# EAGLE board PS4_Main_Schematic_V3 (EAGLE 9.5.2)
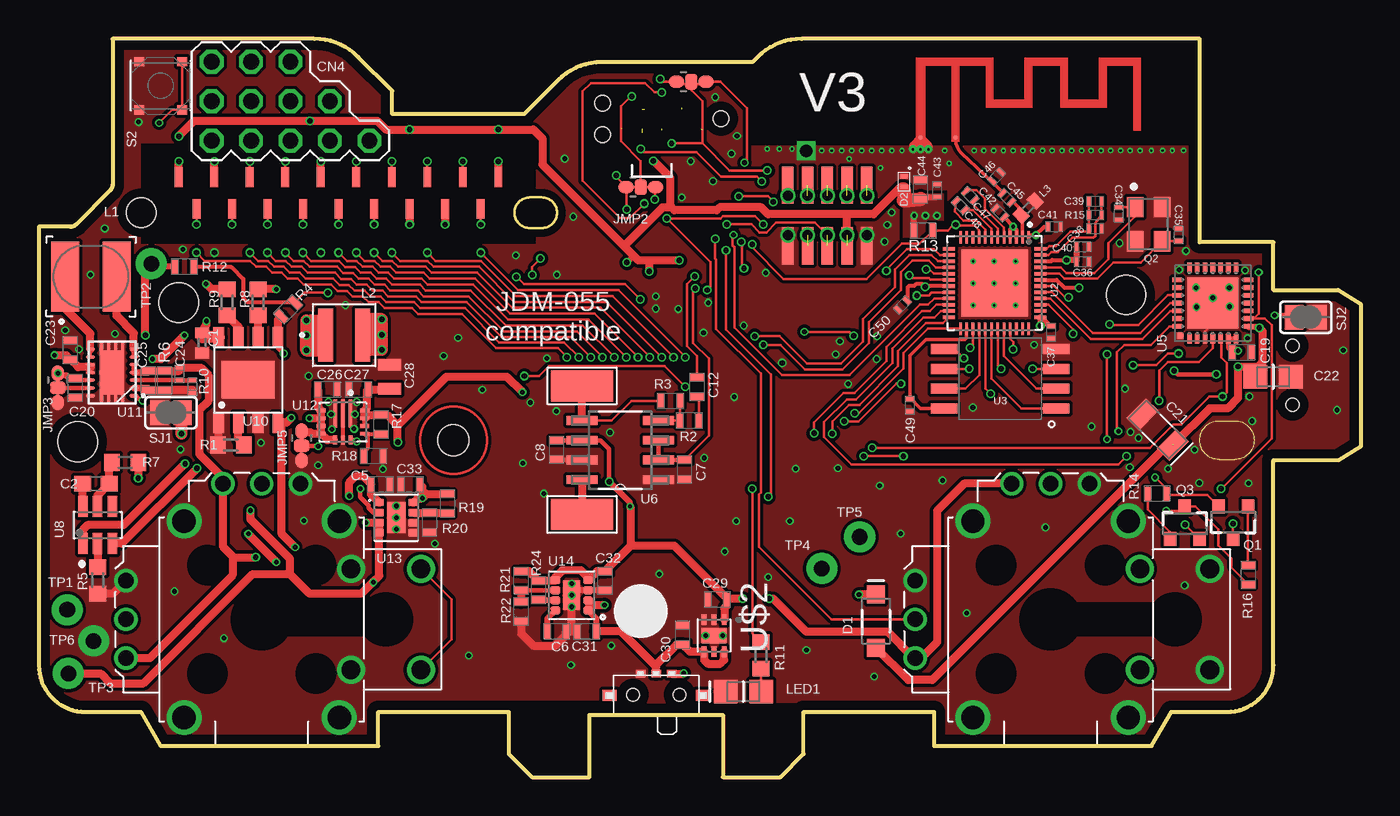
[diagram p2: board, top side]
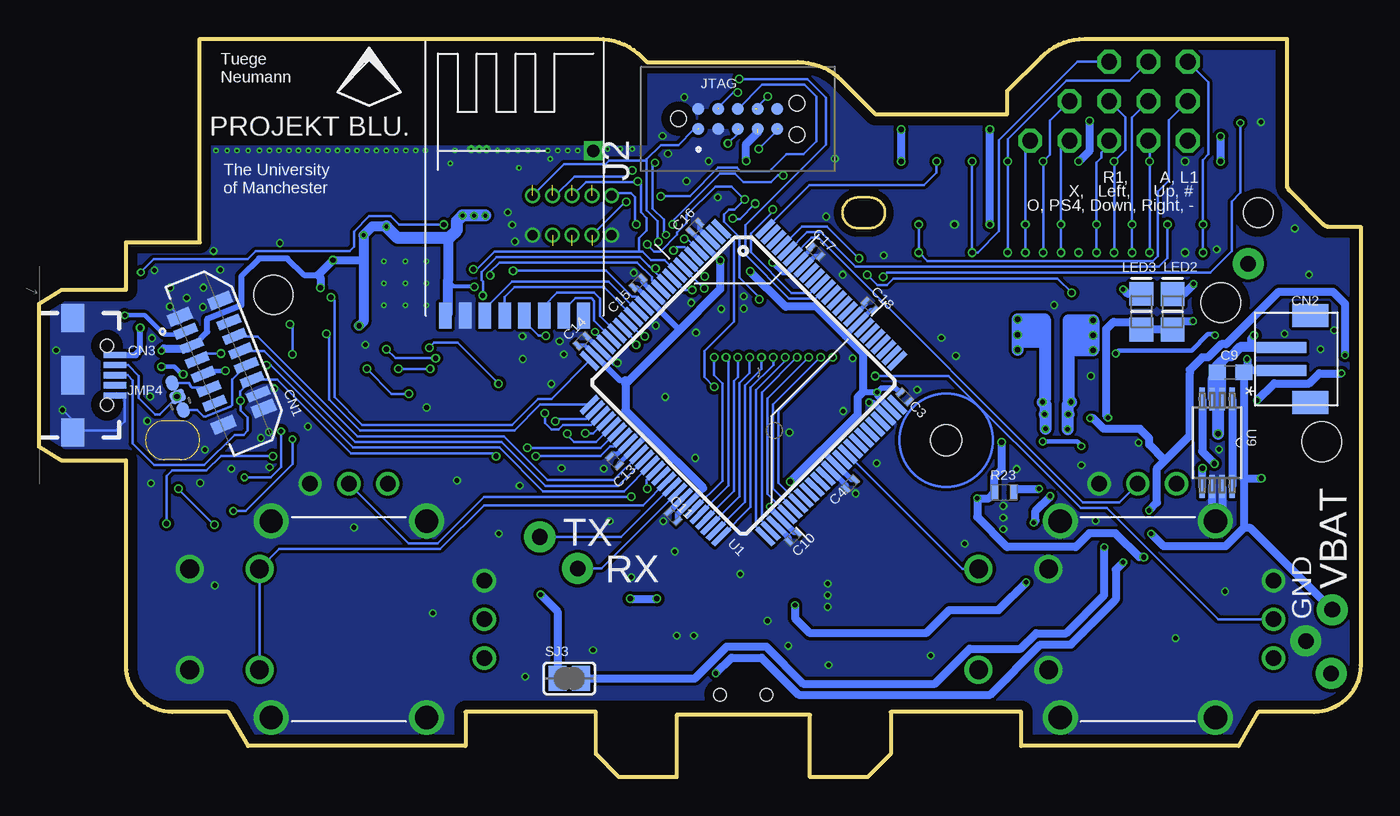
[diagram p3: board, bottom side, seen from below]

Size 85.11 x 47.55 mm. Coordinates in mm from the lower left corner, seen from the top.
Outline: 2.04,35.45 0,35.45 0,7.2 arc90 3,4.2 6.58,4.2 7.85,2 21.85,2 21.85,4.2 30.25,4.2 30.25,1.5 31.75,0 35.45,0 35.45,4 44.05,4 44.05,0 47.75,0 49.25,1.5 49.25,4.2 57.65,4.2 57.65,2 71.65,2 72.92,4.2 76.5,4.2 arc90 79.5,7.2 79.5,20.4 83.67,20.4 85.11,21.29 85.11,30.48 83.67,31.37 79.5,31.37 79.5,34.45 74.75,34.45 74.75,47.55 49.11,47.55 arc45 46.28,46.38 45.95,46.05 36.26,46.05 arc45 33.43,44.88 31.25,42.7 22.75,42.7 22.75,44.2 20.57,46.38 arc45 17.74,47.55 4.75,47.55 4.75,38.16 arc-45 4.6,37.8 2.4,35.6 arc-45 2.04,35.45
Copper layers (1*16): Top 0.035mm / dielectric 0.825mm / Bottom 0.035mm
Design rules "default *": minimum track width 0.1mm, minimum drill 0.2mm, track to track 0.1mm, track to pad 0.1mm, pad to pad 0.1mm, via to via 0mil, smd to smd 0.1mm, copper to edge 0.6mm, drill to drill 5mil, minimum pad ring 0.1mm, minimum via ring 0.1mm, stop-mask expansion 4mil, vias tented up to drill 0mil, thermal gap 0mil
Net classes: 0 Signals: width 0.152 mm, drill 0.3 mm, clearance 0.205 mm; 1 +5V: width 0.508 mm, drill 0.3 mm, clearance 0.205 mm; 2 +3V3: width 0.381 mm, drill 0.3 mm, clearance 0.205 mm; 3 GND: width 0.381 mm, drill 0.3 mm, clearance 0.205 mm
Holes 2.5 mm at 70,31.05
Holes 2.54 mm at 9,30.55 2.5,21.6
Holes 2 mm at 26.7,21.7
tRestrict: area 46,40.7 to 74.8,47.5; area 19.7,24.3 to 20.9,24.5; area 20.5,23.9 to 20.7,24.3; area 18.3,24.3 to 19.5,24.5; area 18.3,23.9 to 18.5,24.3; area 19.7,22 to 19.9,22.5; area 19.3,22 to 19.5,22.5; area 30.4,0.1 to 36.2,4.9; area 43.4,-0.2 to 49.1,4.7
bRestrict: area 46,40.7 to 74.8,47.5; area 41.8,0.1 to 49.2,4.9; area 30.4,0.1 to 36.2,4.9
Milling: 4 lines

## Footprints (pad centres in the part's own frame; a part is rotated, then mirrored left to right if it is on the bottom)
ESP32-ANT = smd 0.295 x 0.295: FEED 0.877,0.457; GND -1.359,0.457
C0402 = smd 0.7 x 0.9: 1 -0.65,0; 2 0.65,0
C0603 = smd 1.1 x 1: 1 -0.85,0; 2 0.85,0
CAPC1005X60N = smd 0.305 x 0.61: 1 -0.406,0; 2 0.406,0
CAPC1608X85N = smd 0.457 x 0.864: 1 -0.61,0; 2 0.61,0
TAN-A = smd 1.118 x 1.778: 1 0,0; 2 2.794,0
CAP0805-NP = smd 1.524 x 1.524: 1 0,0; 2 2.286,0
0805 = smd 0.737 x 1.473: 1 -0.762,0; 2 0.762,0
FFC-12-VERTICAL = smd 0.8 x 1.5: GND1 -3.75,-1.4; GND2 -3.75,1.4; GND3 3.75,-1.4; GND4 3.75,1.4 | smd 0.6 x 1.5: P$1 2.75,1.4; P$2 2.25,-1.4; P$3 1.75,1.4; P$4 1.25,-1.4; P$5 0.75,1.4; P$6 0.25,-1.4; P$7 -0.25,1.4; P$8 -0.75,-1.4; P$9 -1.25,1.4; P$10 -1.75,-1.4; P$11 -2.25,1.4; P$12 -2.75,-1.4
B2B-SM = smd 0.7 x 3.2: P$1 -0.75,3.6; P$2 0.75,3.6 | smd 1.5 x 2.3: P$3 -2.8,1.75; P$4 2.8,1.75
USB-B-MICRO-SMD-RED-OVERHANG = smd 1.45 x 0.4: D+ 2.725,0; D- 2.725,0.65; GND 2.725,-1.3; ID 2.725,-0.65; VBUS 2.725,1.3 | smd 1.5 x 1.8: SHIELD1 0,3.685; SHIELD2 0,-3.685 | smd 1.5 x 2.5: SHIELD3 0,0 | hole 0.85: 2.2,1.9; 2.2,-1.9
MA05-2 = drill 1.016 octagon: 1 -5.08,-1.27; 2 -5.08,1.27; 3 -5.08,3.81; 4 -2.54,-1.27; 5 -2.54,1.27; 6 -2.54,3.81; 7 0,-1.27; 8 0,1.27; 9 0,3.81; 10 2.54,-1.27; 11 2.54,1.27; 12 5.08,-1.27
CARBON-PADS-JDM055 = smd 0.508 x 1.27: 1 22.987,2.286; 2 21.844,0.254; 3 20.701,2.286; 4 19.558,0.254; 5 18.415,2.286; 6 17.272,0.254; 7 16.129,2.286; 8 14.986,0.254; 9 13.843,2.286; 10 12.7,0.254; 11 11.557,2.286; 12 10.414,0.254; 13 9.271,2.286; 14 8.128,0.254; 15 6.985,2.286; 16 5.842,0.254; 17 4.699,2.286; 18 3.556,0.254; 19 2.413,2.286 | hole 1.905: 0,0
SOD-123 = smd 1.143 x 1.143: 1 0,0; 2 3.429,0
DFN100X60X45-2N = smd 0.28 x 0.52: 1 -0.325,0; 2 0.325,0
TAG-CONNECT_TC2050-IDC-NL = smd 0.787 x 0.787: 1 0,0; 2 0,-1.27; 3 0,-2.54; 4 0,-3.81; 5 0,-5.08; 6 1.27,-5.08; 7 1.27,-3.81; 8 1.27,-2.54; 9 1.27,-1.27; 10 1.27,0 | hole 0.991: 1.65,-6.35; -0.38,-6.35; 0.635,1.27
C0R-JMP = smd 0.8 x 1: 1 0,0.938; 3 0,-0.938 | smd 1 x 0.8: 2 0,0
RKJXV1224 = drill 1.2: BTN1 3.25,-5.75; BTN2 3.25,-10.25; BTN3 -3.25,-5.75; BTN4 -3.25,-10.25 | drill 1.5: CASE1 6.325,5; CASE2 -6.325,5; CASE3 -6.325,-5; CASE4 6.325,-5 | drill 1: X1 8.73,-2.5; X2 8.73,0; X3 8.73,2.5; Y1 2.5,8.73; Y2 0,8.73; Y3 -2.5,8.73
M50-3600542 = drill 0.65 pad 0.889: P10_1 2.54,1.27; P$1_1 -2.54,-1.27; P$2_1 -2.54,1.27; P$3_1 -1.27,-1.27; P$4_1 -1.27,1.27; P$5_1 0,-1.27; P$6_1 0,1.27; P$7_1 1.27,-1.27; P$8_1 1.27,1.27; P$9_1 2.54,-1.27 | smd 0.74 x 2.4: P$1 -2.54,-1.95; P$2 -2.54,1.95; P$3 -1.27,-1.95; P$4 -1.27,1.95; P$5 0,-1.95; P$6 0,1.95; P$7 1.27,-1.95; P$8 1.27,1.95; P$9 2.54,-1.95; P$10 2.54,1.95
IND_SDR0403-221KL = smd 4.5 x 1.8: 1 0,1.65; 2 0,-1.65
IND_XFL4020-102MEB = smd 0.98 x 3.4: 1 -1.185,0; 2 1.185,0
INDC1005X45 = smd 0.7 x 0.9: 1 -0.65,0; 2 0.65,0
LED0805 = smd 1.524 x 1.524: 1 0,0; 2 2.286,0
SPEAKER-CONNECTORS-JDM055 = smd 4 x 2: P$1 0,4.14; P$2 0,-4.14
SOT23-3 = smd 0.8 x 0.9: 1 -0.95,-1; 2 0.95,-1; 3 0,1.1
OSCCC320X250X60N = smd 1.31 x 1.06: 1 -1.1,-0.875; 2 1.1,-0.875; 3 1.1,0.875; 4 -1.1,0.875
R0603 = smd 1 x 1.1: 1 -0.85,0; 2 0.85,0
603-AC0402FR-0720KL = smd 0.305 x 0.61: 1 -0.406,0; 2 0.406,0
SSAJ110100 = smd 0.6 x 0.5: 1 -1,2.6; 2 1,2.6; C 0,2.6 | smd 0.9 x 0.7: PAD@1 3,1.2; PAD@2 -3,1.2 | hole 0.8: -1.5,1.25; 1.5,1.25
PTS540 = smd 0.6 x 0.65: 1 -1.55,1.375; 2 1.55,1.375; 3 -1.55,-1.375; 4 1.55,-1.375
SJ = smd 1.168 x 1.6: 1 -0.762,0; 2 0.762,0
SJ-CLOSED = smd 1.168 x 1.6: 1 -0.762,0; 2 0.762,0
TP = drill 1 pad 2: TP 0,0
TQFP100 = smd 1.5 x 0.35: 1 -8,6; 2 -8,5.5; 3 -8,5; 4 -8,4.5; 5 -8,4; 6 -8,3.5; 7 -8,3; 8 -8,2.5; 9 -8,2; 10 -8,1.5; 11 -8,1; 12 -8,0.5; 13 -8,0; 14 -8,-0.5; 15 -8,-1; 16 -8,-1.5; 17 -8,-2; 18 -8,-2.5; 19 -8,-3; 20 -8,-3.5; 21 -8,-4; 22 -8,-4.5; 23 -8,-5; 24 -8,-5.5; 25 -8,-6; 51 8,-6; 52 8,-5.5; 53 8,-5; 54 8,-4.5; 55 8,-4; 56 8,-3.5; 57 8,-3; 58 8,-2.5; 59 8,-2; 60 8,-1.5; 61 8,-1; 62 8,-0.5; 63 8,0; 64 8,0.5; 65 8,1; 66 8,1.5; 67 8,2; 68 8,2.5; 69 8,3; 70 8,3.5; 71 8,4; 72 8,4.5; 73 8,5; 74 8,5.5; 75 8,6 | smd 0.35 x 1.5: 26 -6,-8; 27 -5.5,-8; 28 -5,-8; 29 -4.5,-8; 30 -4,-8; 31 -3.5,-8; 32 -3,-8; 33 -2.5,-8; 34 -2,-8; 35 -1.5,-8; 36 -1,-8; 37 -0.5,-8; 38 0,-8; 39 0.5,-8; 40 1,-8; 41 1.5,-8; 42 2,-8; 43 2.5,-8; 44 3,-8; 45 3.5,-8; 46 4,-8; 47 4.5,-8; 48 5,-8; 49 5.5,-8; 50 6,-8; 76 6,8; 77 5.5,8; 78 5,8; 79 4.5,8; 80 4,8; 81 3.5,8; 82 3,8; 83 2.5,8; 84 2,8; 85 1.5,8; 86 1,8; 87 0.5,8; 88 0,8; 89 -0.5,8; 90 -1,8; 91 -1.5,8; 92 -2,8; 93 -2.5,8; 94 -3,8; 95 -3.5,8; 96 -4,8; 97 -4.5,8; 98 -5,8; 99 -5.5,8; 100 -6,8
QFN35P500X500X90-49N = smd 0.81 x 0.22: 1 -2.945,2.2; 2 -2.945,1.8; 3 -2.945,1.4; 4 -2.945,1; 5 -2.945,0.6; 6 -2.945,0.2; 7 -2.945,-0.2; 8 -2.945,-0.6; 9 -2.945,-1; 10 -2.945,-1.4; 11 -2.945,-1.8; 12 -2.945,-2.2; 25 2.945,-2.2; 26 2.945,-1.8; 27 2.945,-1.4; 28 2.945,-1; 29 2.945,-0.6; 30 2.945,-0.2; 31 2.945,0.2; 32 2.945,0.6; 33 2.945,1; 34 2.945,1.4; 35 2.945,1.8; 36 2.945,2.2 | smd 0.22 x 0.81: 13 -2.2,-2.945; 14 -1.8,-2.945; 15 -1.4,-2.945; 16 -1,-2.945; 17 -0.6,-2.945; 18 -0.2,-2.945; 19 0.2,-2.945; 20 0.6,-2.945; 21 1,-2.945; 22 1.4,-2.945; 23 1.8,-2.945; 24 2.2,-2.945; 37 2.2,2.945; 38 1.8,2.945; 39 1.4,2.945; 40 1,2.945; 41 0.6,2.945; 42 0.2,2.945; 43 -0.2,2.945; 44 -0.6,2.945; 45 -1,2.945; 46 -1.4,2.945; 47 -1.8,2.945; 48 -2.2,2.945 | smd 4.3 x 4.3: 49 0,0
SOIC127P790X216-8N = smd 1.7 x 0.65: 1 -3.6,1.905; 2 -3.6,0.635; 3 -3.6,-0.635; 4 -3.6,-1.905; 5 3.6,-1.905; 6 3.6,-0.635; 7 3.6,0.635; 8 3.6,1.905
NRF24MINI = smd 1.676 x 0.813: 3V3 0,8.89; CE 0,6.35; CSN 0,5.08; GND 0,7.62; IRQ 0,0; MISO 0,1.27; MOSI 0,2.54; SCK 0,3.81 | drill 0.8 square: GND2 10.625,-0.625
MLP28 = smd 0.6 x 0.3: 1 -2.3,1.5; 2 -2.3,1; 3 -2.3,0.5; 4 -2.3,0; 5 -2.3,-0.5; 6 -2.3,-1; 7 -2.3,-1.5; 15 2.3,-1.5; 16 2.3,-1; 17 2.3,-0.5; 18 2.3,0; 19 2.3,0.5; 20 2.3,1; 21 2.3,1.5 | smd 0.3 x 0.6: 8 -1.5,-2.3; 9 -1,-2.3; 10 -0.5,-2.3; 11 0,-2.3; 12 0.5,-2.3; 13 1,-2.3; 14 1.5,-2.3; 22 1.5,2.3; 23 1,2.3; 24 0.5,2.3; 25 0,2.3; 26 -0.5,2.3; 27 -1,2.3; 28 -1.5,2.3 | smd 3.3 x 3.3: EXP 0,0 | smd 0.435 x 0.435: M -2.103,2.103
SOIC127P600X175-8N = smd 1.981 x 0.559: 1 -2.464,1.905; 2 -2.464,0.635; 3 -2.464,-0.635; 4 -2.464,-1.905; 5 2.464,-1.905; 6 2.464,-0.635; 7 2.464,0.635; 8 2.464,1.905
SOT95P285X140-6N = smd 1.35 x 0.6: 1 -1.185,0.95; 2 -1.185,0; 3 -1.185,-0.95; 4 1.185,-0.95; 5 1.185,0; 6 1.185,0.95
SOP65P640X120-8N = smd 1.473 x 0.356: 1 -2.819,0.965; 2 -2.819,0.33; 3 -2.819,-0.33; 4 -2.819,-0.965; 5 2.819,-0.965; 6 2.819,-0.33; 7 2.819,0.33; 8 2.819,0.965
SOP-8 = smd 1.3 x 0.7: 1 -2.75,1.905; 2 -2.75,0.635; 3 -2.75,-0.635; 4 -2.75,-1.905; 5 2.75,-1.905; 6 2.75,-0.635; 7 2.75,0.635; 8 2.75,1.905 | smd 2.413 x 3.429: 9 0,0
QFN14-3X4MM = smd 0.6 x 0.24: 1 -1.4,1.5; 2 -1.4,1; 3 -1.4,0.5; 4 -1.4,0; 5 -1.4,-0.5; 6 -1.4,-1; 7 -1.4,-1.5; 8 1.4,-1.5; 9 1.4,-1; 10 1.4,-0.5; 11 1.4,0; 12 1.4,0.5; 13 1.4,1; 14 1.4,1.5 | smd 1.58 x 2.85: 15 0,0 | smd 0.2 x 0.575: 16 -0.69,1.712; 17 -0.23,1.712; 18 0.23,1.712; 19 0.69,1.712; 20 0.69,-1.712; 21 0.23,-1.712; 22 -0.23,-1.712; 23 -0.69,-1.712
TPS630250 = smd 1.79 x 0.22: 1 -0.555,0.49; 3 -0.555,-0.49 | smd 1.79 x 0.24: 2 -0.555,0 | smd 0.24 x 0.6: 4 -0.75,-1.4; 5 -0.25,-1.4; 6 0.25,-1.4; 7 0.75,-1.4; 11 0.75,1.4; 12 0.25,1.4; 13 -0.25,1.4; 14 -0.75,1.4 | smd 0.6 x 0.24: 8 1.15,-0.5; 9 1.15,0; 10 1.15,0.5
SON65P280X300X133-9N = smd 0.63 x 0.5: 1 -1.1,0.975; 2 -1.1,0.325; 3 -1.1,-0.325; 4 -1.1,-0.975; 5 1.1,-0.975; 6 1.1,-0.325; 7 1.1,0.325; 8 1.1,0.975 | smd 1.2 x 2: 9 0,0 | drill 0.3 pad 0.5: P$1 0,0; P$2 0,0.75; P$3 0,-0.75
PSON65P300X280X153-9N = smd 0.63 x 0.5: 1 -1.05,0.975; 2 -1.05,0.325; 3 -1.05,-0.325; 4 -1.05,-0.975; 5 1.05,-0.975; 6 1.05,-0.325; 7 1.05,0.325; 8 1.05,0.975 | smd 1.1 x 1.9: 9 0,0 | drill 0.3 pad 0.5: 9_1 0,0.75; 9_2 0,0; 9_3 0,-0.75
SON65P200X200X80-7N = smd 0.66 x 0.32: 1 -1.03,0.65; 2 -1.03,0; 3 -1.03,-0.65; 4 1.03,-0.65; 5 1.03,0; 6 1.03,0.65 | smd 1 x 1.6: 7 0,0 | drill 0.3 pad 0.5: 7_1 0,0.55; 7_2 0,-0.55

## Placement (x,y rotation side)
ANT1  ESP32-ANTENNA  [ESP32-ANT]  58.14,40.72 0 top
C1  0.1uF  [C0402]  10.52,27.96 270 top
C2  0.1uF  [C0603]  3.68,18.9 180 top
C3  0.1uF  [CAPC1005X60N]  29.36,24.49 135 bottom
C4  0.1uF  [CAPC1005X60N]  32.87,18.87 45 bottom
C5  10uF  [CAPC1608X85N]  22,18.85 0 top
C6  430pF  [CAPC1608X85N]  33.35,9.37 0 top
C7  0.47uF  [CAPC1608X85N]  41.58,19.81 270 top
C8  0.1uF  [CAPC1608X85N]  33.32,21.08 270 top
C9  10uF  [C0603]  8.38,26.06 180 bottom
C10  0.1uF  [CAPC1005X60N]  36.52,15.47 45 bottom
C11  0.1uF  [CAPC1005X60N]  44.27,16.79 315 bottom
C12  0.47uF  [CAPC1608X85N]  42.37,25.12 90 top
C13  0.1uF  [CAPC1005X60N]  48.06,20.37 315 bottom
C14  0.1uF  [CAPC1005X60N]  50.14,28.09 225 bottom
C15  0.1uF  [CAPC1005X60N]  46.53,31.83 225 bottom
C16  0.1uF  [CAPC1005X60N]  42.85,35.41 225 bottom
C17  0.1uF  [CAPC1005X60N]  35.08,33.83 135 bottom
C18  0.1uF  [CAPC1005X60N]  31.6,30.35 315 bottom
C19  10uF  [CAPC1608X85N]  77.47,27.36 180 top
C20  100nF  [CAPC1608X85N]  2.34,25.07 270 top
C21  4.7uF  [TAN-A]  73.03,21.39 135 top
C22  0.1uF  [CAP0805-NP]  78.33,25.78 0 top
C23  22uF  [CAPC1608X85N]  2.03,27.51 90 top
C24  22uF  [CAPC1608X85N]  8.1,25.55 270 top
C25  22uF  [CAPC1608X85N]  7.03,25.55 270 top
C26  10uF  [CAPC1608X85N]  18.59,24.97 0 top
C27  10uF  [CAPC1608X85N]  20.6,24.97 180 top
C28  47uF  [0805]  22.58,25.78 90 top
C29  22uF  [CAPC1608X85N]  43.69,11.43 180 top
C30  22uF  [CAPC1608X85N]  41.45,9.17 90 top
C31  10uF  [CAPC1608X85N]  35.28,9.37 180 top
C32  22uF  [CAPC1608X85N]  36.47,12.65 270 top
C33  22uF  [CAPC1608X85N]  23.93,18.85 180 top
C34  22pF  [CAPC1005X60N]  69.52,36.3 90 top
C35  22pF  [CAPC1005X60N]  73.38,34.92 270 top
C36  100pF  [CAPC1005X60N]  67.21,33.2 180 top
C37  0.1uF  [CAPC1005X60N]  65.18,28.65 90 top
C38  10nF  [CAPC1005X60N]  68.02,35.31 0 top
C39  3.3nF  [CAPC1005X60N]  68.02,37.08 180 top
C40  1uF  [CAPC1005X60N]  67.21,34.14 180 top
C41  0.1uF  [CAPC1005X60N]  65.39,35.43 180 top
C42  0.1uF  [CAPC1005X60N]  61.87,36.35 315 top
C43  1uF  [CAPC1005X60N]  57.84,37.77 270 top
C44  10uF  [CAPC1608X85N]  56.77,37.85 270 top
C45  4.7pF  [CAPC1005X60N]  62.33,37.31 315 top
C46  2.4pF  [CAPC1005X60N]  61.67,38.68 45 top
C47  270pF  [CAPC1005X60N]  59.97,37.44 315 top
C48  270pF  [CAPC1005X60N]  59.33,36.8 135 top
C49  1uF  [CAPC1005X60N]  56.08,23.95 270 top
C50  0.1uF  [CAPC1005X60N]  55.6,30.4 45 top
CN1  505278-1233  [FFC-12-VERTICAL]  73.33,26.7 112 bottom
CN2  B2B-ZR-SM4-TF  [B2B-SM]  1.5,26.92 90 bottom
CN3  [USB-B-MICRO-SMD-RED-OVERHANG]  82.93,25.88 0 bottom
CN4  [MA05-2]  16.2,42.27 0 top
CP1  [CARBON-PADS-JDM055]  6.6,36.35 0 top
D1  MBR0520  [SOD-123]  53.9,11.76 270 top
D2  ESD 3.3V  [DFN100X60X45-2N]  55.7,38.35 270 top
J2  TC2050-IDC-NL  [TAG-CONNECT_TC2050-IDC-NL]  42.65,41.76 90 bottom
JMP2  0R-JUMPC  [C0R-JMP]  38.76,38 90 top
JMP3  0R-JUMPC  [C0R-JMP]  1.23,25.07 0 top
JMP4  0R-JUMPC  [C0R-JMP]  76.17,24.51 202 bottom
JMP5  0R-JUMPC  [C0R-JMP]  16.92,21.34 0 top
JOYSTICK3  RKJXV1224002RKJXV1224002  [RKJXV1224]  65.15,10.16 90 top
JOYSTICK4  RKJXV1224002RKJXV1224002  [RKJXV1224]  14.35,10.16 90 top
JTAG  0R-JUMPC  [C0R-JMP]  42.01,44.78 90 top
JTAG/PDI2  SWD-10SMD/PTH  [M50-3600542]  50.77,36.17 0 top
L1  SDR0403-1R0ML  [IND_SDR0403-221KL]  3.35,32.23 90 top
L2  INDUCTOR_XFL4020-102MEB  [IND_XFL4020-102MEB]  19.66,28.47 0 top
L3  2.4nH  [INDC1005X45]  63.7,36.65 45 top
LED1  Orange Custom  [LED0805]  44.22,5.51 0 top
LED2  RED-Charging  [LED0805]  12.11,31.11 270 bottom
LED3  BLUE-Standby  [LED0805]  14.12,31.12 270 bottom
LS1  SPEAKER-CONNECTORS-JDM055  [SPEAKER-CONNECTORS-JDM055]  34.97,21.06 0 top
Q1  mmbt2222  [SOT23-3]  76.91,16.43 180 top
Q2  [OSCCC320X250X60N]  71.45,35.61 270 top
Q3  mmbt2222  [SOT23-3]  73.79,16.33 0 top
R1  1.5K  [R0603]  12.37,21.39 0 top
R2  10K  [CAPC1608X85N]  41.88,22.96 180 top
R3  50K  [CAPC1608X85N]  40.66,24.23 180 top
R4  100K  [CAPC1608X85N]  16.05,30.12 225 top
R5  1K  [R0603]  3.78,12.68 90 top
R6  768K  [CAPC1005X60N]  9.04,25.96 90 top
R7  100  [R0603]  5.56,20.27 0 top
R8  0K  [R0603]  14.12,30.58 270 top
R9  0K  [R0603]  12.14,30.58 270 top
R10  137K  [CAPC1005X60N]  9.88,25.15 90 top
R11  0K  [R0603]  46.51,7.85 270 top
R12  100K  [CAPC1608X85N]  9.37,32.87 0 top
R13  10K  [CAPC1608X85N]  56.95,35.2 180 top
R14  10K  [CAPC1608X85N]  72.01,18.26 0 top
R15  20K  [603-AC0402FR-0720KL]  68.02,36.19 0 top
R16  10K  [CAPC1608X85N]  77.88,13.03 270 top
R17  562K  [CAPC1608X85N]  22.05,22.71 90 top
R18  180K  [CAPC1608X85N]  21.56,20.68 180 top
R19  510K  [CAPC1608X85N]  26.31,17.63 90 top
R20  162K  [CAPC1608X85N]  25.17,16.41 90 top
R21  309K  [CAPC1608X85N]  31.06,12.65 90 top
R22  100K  [CAPC1608X85N]  31.06,10.67 90 top
R23  499K  [CAPC1608X85N]  22.96,18.34 180 bottom
R24  100K  [CAPC1608X85N]  32.18,12.04 270 top
S1  SSAJ110100  [SSAJ110100]  39.75,4.06 0 top
S2  ULTRA-THIN-TACT-SWITCHPTS540  [PTS540]  7.85,44.53 270 top
SJ1  SJ  [SJ]  8.51,23.47 0 top
SJ2  SJ  [SJ]  81.58,29.62 180 top
SJ3  SJ-CLOSED  [SJ-CLOSED]  50.95,6.35 180 bottom
TP1  TP  [TP]  1.83,10.77 90 top
TP2  TP  [TP]  7.24,33.07 90 top
TP3  TP  [TP]  1.9,6.68 270 top
TP4  TP  [TP]  50.42,13.44 0 top
TP5  TP  [TP]  52.86,15.47 0 top
TP6  TP  [TP]  3.53,8.76 270 top
U1  XMEGA128A1U  [TQFP100]  39.75,25.4 315 bottom
U2  ESP32-D0WDQ6  [QFN35P500X500X90-49N]  61.54,31.83 270 top
U3  GD25Q32CSIGR  [SOIC127P790X216-8N]  61.9,25.65 180 top
U4  NRF24MINI  [NRF24MINI]  50.04,29.72 90 bottom
U5  CP2102  [MLP28]  75.59,30.53 90 top
U6  TPA4861D  [SOIC127P600X175-8N]  37.44,21.06 180 top
U8  DW01A  [SOT95P285X140-6N]  3.78,16.23 90 top
U9  FS8205A  [SOP65P640X120-8N]  9.24,21.54 270 bottom
U10  TP4056  [SOP-8]  13.49,25.58 90 top
U11  TPS63020  [QFN14-3X4MM]  4.72,26.06 180 top
U12  TPS630250RNCT  [TPS630250]  19.58,22.86 270 top
U13  TPS82085SILT8-MICRO_SIP  [SON65P280X300X133-9N]  23.01,16.71 0 top
U14  TPS82130SILR  [PSON65P300X280X153-9N]  34.31,11.71 180 top
U$2  LDO-3V3WSON  [SON65P200X200X80-7N]  43.48,9.12 270 top

## Tracks (layer width: path | path; a pad name or v marks a point on that pad's centre or on a via)
3V3  (via drill 0.25, 0.25 pad 0.51, 0.3, 0.35)  (3 unrouted)
  Top 0.152: v57.07,31.57 57.07,31.63 | D2.2 55.7,37.84 | U2.19
  Top 0.254: U2.19 57.07,31.63 | C50.2 55.94,30.74 55.94,31.54 56.05,31.65 56.37,31.65 56.46,31.75 56.47,31.75 | v66.17,33.3 65.26,33.3 65.18,33.22 65.18,33.23 U2.46 | v66.98,31.52 66.04,31.52 65.53,32.03 U2.43 | C42.2 62.72,35.5 | C41.2 64.72,35.43 64.21,34.92 v64.21,34.9 63.87,34.9 U2.1 | U2.4 62.54,35.26 v62.74,35.46 62.94,35.25 U2.3 | U12.12 U12.13 | U11.4 U11.5 | v57.07,31.57 56.89,31.75 56.47,31.75
  Top 0.305: C19.2 76.59,27.63 U5.6 U5.7 | C8.1 U6.6 36.17,21.69 36.73,21.13 v36.73,19.02
  Top 0.356: v37.87,33.15 38.3,33.58 | v38.07,17.42 38.07,17.68 v36.73,19.02
  Top 0.381: 62.72,35.5 arc-45 v62.74,35.46 | v64.49,29.06 64.49,29.52 | U2.37 64.49,29.52 | v66.17,33.3 66.7,33.3 C36.2 C40.2 | C37.2 65.06,29.06 64.59,29.52 64.49,29.52 | R13.2 56.34,36.14 v56.36,36.17 | C44.2 56.9,37.36 C43.2
  Top 0.406: U11.4 7.03,26.06 C25.1
  Top 0.508: CP1.19 v9.02,39.65 | CP1.11 v18.16,39.65 | CP1.1 v29.59,39.65 | CP1.6 v23.88,35.59 | v9.02,41.27 10.01,42.27 v17.45,42.27 21.79,42.27 22.35,41.71 v23.88,41.71 v29.59,41.71 31.85,41.71 32.44,41.12 32.44,39.45 37.67,34.21 | v41.25,33.27 39.32,33.27 | 39.32,33.27 38.61,33.27 38.3,33.58 38.29,33.59 37.67,34.21 | C25.1 C24.1 9.04,26.16 R6.2 10.44,26.36 10.92,25.88 10.92,24.23 10.34,23.65 10.34,20.8 11.85,19.29 JOYSTICK4.X3 11.85,14.86 12.48,14.23 | U13.8 24.38,17.96 v24.69,17.96 | D2.2 55.52,38.03 53.74,36.25 52.04,36.25 | C19.2 76.96,27.46 v77.22,27.46 | v39.32,32.56 39.32,33.27 | C28.1 22.58,24.97 C27.1 21.13,24.89 21.13,23.77 U12.14 U12.13 21.19,23.32 R17.2 22.45,23.32 23.11,22.66 | 12.48,14.23 12.48,12.99 7.15,7.66 JOYSTICK4.Y3 | v23.11,21.57 23.11,22.66 | 12.48,14.23 12.54,14.16 v13.96,14.16 v13.96,14.17 | C33.1 24.69,18.69 v24.69,17.96 | v24.69,17.96 24.97,18.24 R19.2 | v31.14,24.79 30.15,25.78 26.24,25.78 23.11,22.66 | R21.2 31.57,13.26 R24.1 33.23,12.65 U14.5 33.26,12.86 33.72,13.32 34.91,13.32 35.36,12.86 U14.4 35.94,13.26 C32.1 36.47,13.27 38.09,14.89 | v38.07,17.42 38.09,17.4 38.09,14.89 | 37.67,34.21 40.15,36.69 40.66,36.69 | C29.1 44.3,11.05 44.14,10.9 44.14,10.16 U$2.1 | JOYSTICK3.X3 62.63,18.91 59.59,18.91 57.83,17.14 57.83,8.69 56.8,7.66 JOYSTICK3.Y3 56.36,7.66 54.66,9.36 49.41,9.36 47.29,11.48 v47.04,11.48 | v45.31,11.48 44.35,11.48 C29.1 | C29.1 44.3,11.52 40.92,14.89 38.09,14.89 | 52.04,36.25 46.96,36.25 46.51,36.7 43.84,36.7 43.65,36.52 40.92,36.52 40.74,36.69 40.66,36.69 | JTAG/PDI2.P$7 52.04,36.25 | v39.57,39.7 40.66,38.61 40.66,36.69
  Top 0.889: C44.2 55.7,37.13 55.7,37.84
  Bottom 0.254: 58.78,31.98 58.42,31.62 57.12,31.62 v57.07,31.57 | U1.24 49.32,27.17 49.96,27.8 C14.2
  Bottom 0.305: C13.2 47.77,20.21 U1.34 | U1.4 43.11,35.12 C16.2 | U1.14 46.6,31.54 C15.2 | U1.94 35.36,34.03 C17.2 | U1.83 31.55,30.07 C18.2
  Bottom 0.356: U1.74 31.14,24.57 v31.14,24.79 30.86,25.07 29.95,25.07 C3.2 | U1.83 33.19,28.43 | U1.4 v41.26,33.27 v41.25,33.27 | 34.68,21.07 34.68,21.04 U1.64 32.8,19.16 C4.2 | U1.34 45.86,22.12 45.86,22.14 | U1.24 47.68,25.55 47.34,25.55 | U1.94 36.91,32.48 37.21,32.48 v37.87,33.15 | U1.14 43.99,28.93 43.99,28.68 | C10.2 36.47,15.76 U1.54 38.07,17.36 v38.07,17.42 | 42.33,18.61 42.33,18.58 U1.44 43.98,16.92 C11.2
  Bottom 0.381: 67.13,32.33 68.05,32.33 69.11,33.4 70.94,33.4 72.08,32.26 72.08,30.38 74.26,29.5 74.26,28.69 75.16,27.79 CN1.P$3 | v31.14,24.79 32,24.79 32.03,24.82
  Bottom 0.508: 64.21,33.35 64.26,33.3 v66.17,33.3 67.13,32.33 66.98,32.18 v66.98,31.52 | v9.02,39.65 v9.02,41.27 | v29.59,41.71 v29.59,39.65 | v23.88,35.59 v23.88,41.71 | v18.16,39.65 17.45,40.36 v17.45,42.27 | v41.25,33.27 41.25,31.42 43.99,28.68 47.34,25.32 | 47.34,25.55 47.34,25.32 | 47.34,25.32 47.34,23.62 45.86,22.14 42.33,18.61 | v36.73,19.02 34.68,21.07 | v24.69,17.96 23.95,17.96 R23.2 23.57,19.38 23.11,19.84 v23.11,21.57 | v77.22,27.46 77.06,27.62 75.46,27.62 CN1.P$3 | v39.32,32.56 v39.31,32.56 37.04,30.29 35.05,30.29 33.19,28.43 32.03,27.27 32.03,24.82 32.37,24.48 32.37,23.35 34.68,21.04 | v13.96,14.17 14.27,14.17 15.8,15.7 17.47,15.7 18.35,14.82 22.77,14.82 24.69,16.74 v24.69,17.96 | v24.69,17.96 | v47.04,11.48 v45.31,11.48 | v39.57,39.7 39.57,40.77 38.84,41.5
  Bottom 0.635: v62.74,35.46 63.65,35.46 v64.21,34.9 64.21,33.35 64.21,29.34 v64.49,29.06 | 58.78,34.72 58.78,31.98 58.78,29.87 U4.3V3
  Bottom 0.762: v62.74,35.46 62,34.72 58.78,34.72 58.75,34.75 58.69,34.75 58.2,35.24 58.2,35.81 v57.84,36.17 v57.1,36.17 v56.36,36.17
  pour Top: 58.27,37.57 58.27,35.84 57.18,35.84 57.18,34.75 55.65,34.75 55.65,37.57
#  (via drill 0.35)
  Top 0.152: v41.63,27.05 37.31,31.37 30.86,31.37 v28.45,33.78 | CP1.2 v28.45,35.59
  Bottom 0.152: v41.63,27.05 41.63,25.88 41.1,25.35 41.1,19.09 42.91,17.27 U1.45 | v28.45,35.59 v28.45,33.78 28.43,33.77 28.42,33.77 27.91,33.25 13.37,33.25 13.06,33.56 13.06,37.69 12.34,38.41 12.34,42.32 CN4.2
+5V  (via drill 0.3)
  Top 0.508: D1.1 v52.81,11.76 | v52.81,11.76
  Bottom 0.508: v52.81,11.76 51.72,10.67 SJ3.2
A  (via drill 0.35)
  Top 0.152: CP1.7 v22.73,39.65 | v22.73,33.78 23.27,33.25 25.04,33.25 25.42,32.87 28.34,32.87 30.61,30.61 36.55,30.61 v40.11,27.05
  Bottom 0.152: v22.73,33.78 v22.73,39.65 22.73,41.08 18.95,44.86 14.88,44.86 CN4.6 | v40.11,27.05 40.11,25.77 40.35,25.52 40.35,18.43 U1.47
B_LED
  Bottom 0.152: U1.35 46.42,20.8 48.09,19.12 52.35,19.12 55.17,21.95 64.59,21.95 71.02,28.38 CN1.P$4
BATTERY_READOUT  (via drill 0.35)
  Top 0.152: R4.1 17.12,31.19 v18.6,31.19 | v31.76,32.34 31.76,32.86 v32.3,33.4
  Top 0.254: R12.2 10.01,32.84 12.4,32.84 13.16,32.08 13.16,30.84 13.41,30.6 16.44,30.6 R4.1
  Bottom 0.152: v18.6,31.19 19.51,32.11 30.09,32.11 30.52,31.68 31.1,31.68 v31.76,32.34 | U1.97 37.21,34.24 35.99,35.46 34.37,35.46 v32.3,33.4
CBUS0_RX/TX  (via drill 0.35)
  Top 0.152: v55.51,25.34 55.21,25.34 52.78,22.91 v51.87,22.91 v51.86,22.92 | v59.97,27.66 60.14,27.83 U2.27
  Bottom 0.152: U1.27 49.88,23.05 51.73,23.05 v51.86,22.92 | v59.97,27.66 59.97,27.68 59.67,27.98 58.15,27.98 v55.51,25.34
CBUS1_TX/RX  (via drill 0.35)
  Top 0.152: v52.53,23.44 52.81,23.44 55.68,26.31 55.68,27.3 57.25,28.88 U2.25
  Bottom 0.152: U1.28 49.55,22.67 51.36,22.67 51.65,22.38 52.09,22.38 52.53,22.81 v52.53,23.44
CBUS2  (via drill 0.35)
  Top 0.152: U2.24 58.22,29.25 57.11,29.25 55.32,27.45 55.32,26.46 52.83,23.98 52.17,23.98 51.1,22.91 v51.1,22.12
  Bottom 0.152: U1.30 49.22,21.58 50.66,21.58 51.1,22.02 v51.1,22.12
CBUS3  (via drill 0.35)
  Top 0.152: U2.22 57.79,30.43 57.38,30.02 56.87,30.02 54.56,27.71 54.56,26.79 52.53,24.75 51.82,24.75 49.92,22.85 v49.92,22.14
  Bottom 0.152: U1.29 48.65,22.93 49.44,22.13 v49.91,22.13 v49.92,22.14
CBUS4  (via drill 0.35)
  Top 0.152: v46.66,27.84 47.75,27.84 49.33,26.26 51.76,26.26 53.44,27.94 53.44,29.32 55.5,31.37 55.5,32.52 56.24,33.26 57.33,33.26 57.76,32.83 U2.16
  Bottom 0.152: U1.19 46.66,28.07 v46.66,27.84
CBUS5  (via drill 0.35)
  Top 0.152: v46.1,28.4 47.7,28.4 49.45,26.64 51.64,26.64 53.06,28.07 53.06,29.49 55.12,31.55 55.12,32.69 56.06,33.63 57.48,33.63 57.89,33.23 U2.15
  Bottom 0.152: U1.18 46.28,28.4 v46.1,28.4
CBUS6  (via drill 0.35)
  Top 0.152: U2.14 58.02,33.63 57.63,34.01 55.91,34.01 54.58,32.68 v54.58,32.61
  Bottom 0.152: U1.15 46.7,30.93 46.93,30.93 48.6,32.61 v54.58,32.61
CE_NRF24
  Bottom 0.152: U4.CE 56.39,30.18 54.65,31.91 48.43,31.91 46.52,30 U1.16
CSN_NRF24
  Bottom 0.152: U4.CSN 55.12,30.91 54.48,31.55 48.73,31.55 U1.17
D-_BACKUP
  Bottom 0.152: JMP4.1 74.91,23.64 74.49,23.22 74.37,23.22 72.76,23.87 72.67,23.96 72.67,25.6 CN1.P$8
D-_CONNECTED
  Bottom 0.152: JMP4.3 75.42,25.38 75.33,25.17 75.24,25.08 74.22,25.08 CN1.P$9
DOWN  (via drill 0.35)
  Top 0.152: CP1.12 v17.02,35.59 | v17.02,33.78 17.55,33.25 19.33,33.25 19.73,32.84 20.37,32.84 20.73,32.49 21.36,32.49 21.74,32.11 22.38,32.11 22.76,31.73 24.54,31.73 24.92,31.34 27.81,31.34 30.07,29.08 35.03,29.08 v37.06,27.05
  Bottom 0.152: v17.02,33.78 v17.02,35.59 17.02,39.58 16.68,39.91 16.68,40.21 16.2,40.69 CN4.7 | v37.06,27.05 37.06,26.79 38.92,24.93 38.92,16.15 38.34,15.56 U1.51
DTR  (via drill 0.3)
  Top 0.152: Q1.2 75.23,18.16 72.72,18.16 R14.2 72.62,18.57 v71.88,19.3 | U5.28 72.81,29.03 71.61,27.84 69.89,27.84 69.42,27.37 69.42,22.38 v69.52,22.28
  Bottom 0.152: v71.88,19.3 70.18,19.3 69.52,19.96 v69.52,22.28
FEED
  Top 0.229: ANT1.FEED arc45 59.44,40.15 61.33,38.4 C46.1 61.38,38.35 62.09,37.64 C45.1
G_LED
  Bottom 0.152: U1.36 46.12,20.45 47.81,18.77 52.49,18.77 55.32,21.59 64.74,21.59 70.6,27.45 CN1.P$6
GND  (via drill 0.15, 0.15 pad 0.51, 0.3, 0.35)
  Top 0.152: U5.3 75.09,28.71 v76.68,30.3
  Top 0.254: U12.9 U12.2
  Top 0.305: U6.7 33.32,20.42 C8.2
  Top 0.381: C32.2 U14.3 34.31,12.03 U14.9_2
  Top 0.406: U11.2 7.03,25.06 C25.2
  Top 0.508: ANT1.GND 56.29,40.68 v56.29,40.44 | ANT1.GND 57.28,40.68 v57.28,40.44 | ANT1.GND 56.78,40.45 v56.77,40.44 | CP1.17 v11.3,39.65 | CP1.4 v26.16,35.59 | R22.1 31.06,9.25 31.85,8.46 33.25,8.46 33.96,9.17 C6.2 | C6.2 C31.2 | C6.2 34.31,9.73 U14.9_1 | R5.1 4.79,11.83 JOYSTICK4.Y1 | C25.2 7.77,24.94 | 7.77,24.94 C24.2 | R10.1 9.88,24.94 8.28,24.94 7.77,24.94 | R1.1 11.58,21.45 U10.1
  Bottom 0.152: CN3.GND 79.67,24.58 79.58,24.49 79.58,22.91 80.16,22.33 82.27,22.33 v83.59,23.65 | CN1.GND4 v76.68,30.3
  Bottom 0.305: U1.33 47.86,20.82 48.18,20.82 C13.1 | U1.3 42.56,35.28 C16.1 | U1.13 46.24,31.89 C15.1 | U1.23 49.8,28.38 C14.1 | U1.93 35.14,33.55 C17.1 | U1.84 31.88,30.44 C18.1
  Bottom 0.356: U1.73 31.41,24.13 v31.65,24.13 | U1.23 48.09,26.67 v47.88,26.67 | U1.63 33.15,18.8 C4.1 | U1.53 36.81,15.39 C10.1 | U1.43 44.54,17.08 C11.1
  Bottom 0.508: U9.7 8.91,16.92 JOYSTICK4.CASE1 9.57,16.71 U9.6
  other vias: 55.58,40.35 54.28,40.35 53.64,40.35 54.93,40.35 52.99,40.35 52.34,40.35 51.7,40.35 51.05,40.35 50.4,40.35 58.32,40.35 60.22,40.35 60.85,40.35 61.48,40.35 62.11,40.35 62.74,40.35 63.36,40.35 63.99,40.35 64.62,40.35 65.25,40.35 65.88,40.35 66.51,40.35 67.13,40.35 67.76,40.35 68.39,40.35 69.02,40.35 69.65,40.35 70.28,40.35 70.9,40.35 71.63,40.35 54.2,39.23 52.19,39.81 58.61,39.53 60.16,30.38 61.53,30.38 62.89,30.38 62.89,31.79 61.53,31.79 60.16,31.79 60.16,33.21 61.53,33.21 62.89,33.21 11.3,33.78 72.36,40.35 72.99,40.35 73.72,40.35 46.91,40.45 47.69,40.45 48.5,40.45 64.08,27.84 49.43,8.18 53.8,6.48 59.74,10.57 64.82,16.08 55.5,15.67 46.96,12.88 48.36,16.48 44.17,14.53 39.95,13.08 34.26,7.21 27.69,7.82 36.85,8.46 38.2,10.06 32.51,18.26 31.16,20.22 25.5,15.04 22.15,19.84 17.07,16.51 17.98,20.09 8.74,11.96 11.91,8.94 9.12,21.11 14.3,21.54 17.37,25.83 19.73,30.4 3.33,32.36 4.24,35.33 6.43,42.19 9.27,33.99 84,27.48 77.9,18.92 73.79,12.34 70.31,22.23 67.79,22.58 60.15,23.8 75.59,30.86 74.55,30.28 74.52,31.52 76.66,31.52 73.43,32.66 77.67,32.64 69.59,34.39 73.86,33.88 54.91,36.37 54.63,35.56 41.4,37.34 43.41,38.38 51.31,27.23 51.59,28.07 46.81,32.49 43.1,30.56 44.91,16.48 28.55,24.94 27,28.3 33.35,32.36 30.71,33.6 34.42,36.09 45.39,29.08 53.95,26.92 52.12,25.32 48.74,19.86 51.46,19.89 54.15,18.77 58.19,19.1 54.46,34.49 53.97,28.4 1.7,28.78 4.9,28.55 2.59,27.56 74.42,21.08 70.81,21.84 72.72,19.86 74.73,18.95 70.26,19.96 77.95,24.51 77.82,28.27 78.13,22.94 69.95,25.02 39.72,30.96 39.72,30.18 26.06,27.13 33.32,23.57 32.71,26.97 36.78,22.2 42.85,20.55 41.17,30.15 42.8,28.63 44.78,24.49 43.56,43.79 33.86,39.83 41.99,39.67 44.6,40.16 44.96,41.3
  pour Top (rank 3): 114,-13.28 114,54.13 -23.77,54.13 -23.77,-13.28
  pour Bottom: 114.96,-13.08 114.96,55.7 -25.3,55.7 -25.3,-13.08
GPIO0  (via drill 0.35)
  Top 0.152: U2.23 58.59,30.02 58.09,30.02 57.68,29.6 56.97,29.6 54.96,27.6 54.96,26.68 52.62,24.34 52.02,24.34 50.57,22.88 50.57,21.9 52.33,20.14 69.52,20.14 v70.05,20.68 | v76.88,16.33 76.88,15.36 Q1.3
  Bottom 0.152: v70.05,20.68 73.38,20.68 74.32,19.73 76.53,19.73 76.88,19.38 v76.88,16.33
L1  (via drill 0.35)
  Top 0.152: CP1.18 v10.16,35.59 | v34.01,27.05 33.43,27.63 29.45,27.63 27.26,29.82 24.41,29.82 24.03,30.2 22.25,30.2 21.87,30.58 21.23,30.58 20.85,30.96 20.19,30.96 19.84,31.32 19.23,31.32 18.82,31.73 17.04,31.73 16.66,32.11 16.03,32.11 15.64,32.49 15.01,32.49 14.63,32.87 13.99,32.87 13.61,33.25 10.69,33.25 v10.16,33.78
  Bottom 0.152: v10.16,33.78 v10.16,35.59 10.16,39.75 9.8,40.11 9.8,44.76 CN4.3 | U1.57 36.21,17.68 37.48,18.95 37.48,23.58 v34.01,27.05
L2  (via drill 0.35)
  Top 0.152: CP1.16 v12.44,35.59 v12.45,35.59
  Bottom 0.152: v12.45,35.59 12.45,33.43 13,32.87 32.53,32.87 34.77,35.11 35.64,35.11 36.86,33.88 U1.96
L23  (via drill 0.35)
  other vias: 18.16,33.78
LEFT  (via drill 0.35)
  Top 0.152: CP1.13 v15.87,39.65 | v15.87,33.78 16.41,33.25 17.04,33.25 17.42,32.87 19.2,32.87 19.61,32.46 20.24,32.46 20.6,32.11 21.23,32.11 21.61,31.73 22.25,31.73 22.63,31.34 24.41,31.34 24.79,30.96 27.69,30.96 29.95,28.7 34.64,28.7 v36.3,27.05
  Bottom 0.152: v15.87,33.78 v15.87,39.65 15.87,39.67 15.16,40.39 15.16,42.49 CN4.8 | U1.52 37.98,15.92 38.56,16.5 38.56,24.78 v36.3,27.05
LJS-BTN
  Top 0.152: JOYSTICK4.BTN2 26.57,11.44 26.57,8.88 JOYSTICK4.BTN4
  Bottom 0.152: JOYSTICK4.BTN2 25.64,13.41 U1.66
LJS-X
  Bottom 0.152: JOYSTICK4.X2 15.54,17.7 17.88,17.7 34.93,34.75 35.35,34.75 U1.95
LJS-Y  (via drill 0.35)
  Top 0.152: v31.27,25.83 32.21,25.83 32.86,26.48 40.28,26.48 v41.63,25.13
  Bottom 0.152: JOYSTICK4.Y2 9.18,10.16 16.34,17.32 18.03,17.32 26.54,25.83 v31.27,25.83 | v41.63,25.13 42.26,25.76 42.26,27.45 40.36,29.35 40.36,34.49 U1.1
MISO_PORTC
  Bottom 0.152: U1.21 48.23,28.28 49.35,29.39 49.35,30.67 49.51,30.84 50.56,30.84 51.31,30.09 U4.MISO
MOSI_PORTC
  Bottom 0.152: U1.20 48.99,29.69 48.99,30.82 49.37,31.2 51.73,31.2 52.58,30.35 U4.MOSI
N$1
  Top 0.254: U11.9 U11.8
  Top 0.508: U11.8 3.32,28.55 1.7,30.18 L1.1
N$3
  Top 0.152: C12.1 42.49,24.38 R2.1
N$4
  Top 0.152: U6.4 R2.2 R3.1
N$7
  Top 0.254: U11.6 U11.7
  Top 0.508: U11.7 6.12,28.6 5,29.72 L1.2
N$8
  Top 0.508: U8.2 R5.2
N$9
  Top 0.508: U8.5 3.78,18.15 C2.1 4.53,20.09 R7.1
N$10  (via drill 0.35)
  Top 0.508: v10.18,19.89 5.34,15.05 U8.3
  Bottom 0.508: U9.5 10.21,19.86 v10.18,19.89
N$11  (via drill 0.35)
  Top 0.508: U8.1 2.83,15.92 3.14,16.23 5.46,16.23 v9.42,20.19
  Bottom 0.508: U9.4 10.21,20.98 v9.42,20.19
N$14  (1 unrouted)
N$41
  Top 0.508: U8.6 C2.2
N$42  (via drill 0.35)
  Top 0.381: R12.1 7.44,32.87 TP2.TP
  Top 0.508: v6.86,28.45 6.86,32.69 TP2.TP
  Top 0.762: v9.19,22.12 9.19,23.39 SJ1.2
  Bottom 0.508: C9.2 9.57,25.72 U9.3 9.23,24.7 C9.2 | U9.2 8.93,24.37 8.93,25.76 C9.2 | 7.03,27.73 7.03,28.27 v6.86,28.45
  Bottom 0.635: CN2.P$2 5.15,27.73 7.03,27.73 7.71,27.73 8.33,27.1 8.66,27.1 9.23,26.53 C9.2
  Bottom 0.762: 9.23,24.7 9.19,24.66 v9.19,22.12
N$43
  Bottom 0.508: U9.1 U9.8
N$44
  Top 0.508: R1.2 12.85,21.76 U10.2
N$45  (via drill 0.3)
  Top 0.508: R9.1 11.12,31.43 10.77,31.78 v10.75,31.76
  Bottom 0.508: v10.75,31.76 11.4,31.11 LED2.1
N$46  (via drill 0.3)
  Top 0.508: v15.29,31.42 v15.28,31.43 R8.1
  Bottom 0.508: LED3.1 14.99,31.12 v15.29,31.42
N$47
  Top 0.508: U10.7 12.85,29.02 R9.2
N$49
  Top 0.508: U10.6 R8.2
N$51  (via drill 0.3)
  Top 0.508: v16.51,14.81 15.61,15.71 15.61,22.66 15.44,22.83 U10.4 15.94,22.83 v16.25,23.14 | 10.52,28.33 C1.1 10.52,28.77 10.68,29.02 10.79,29.12 v10.79,29.37
  Top 0.762: U10.8 10.52,28.33
  Bottom 0.508: SJ3.1 42.87,6.35 40.81,8.41 38.29,8.41 35.9,6.02 27.41,6.02 25.16,8.27 21.9,8.27 20.89,9.27 18.96,9.27 16.51,11.73 v16.51,14.81 | v16.25,23.14 16.41,23.29 16.41,28.83 15.92,29.31 14.6,29.31 LED3.2 LED2.2 11.59,29.35 10.8,29.35 v10.79,29.37
N$53  (via drill 0.3)
  Top 0.305: v79.58,29.74 80.69,29.74 SJ2.2
  Bottom 0.305: CN1.P$1 75.9,28.72 76.12,28.5 77.04,28.5 78.28,29.74 v79.58,29.74
N$55
  Top 0.152: Q1.1 77.86,13.65 R16.1
N$56
  Top 0.152: Q3.1 72.84,15.79 71.4,17.23 R14.1
N$57  (via drill 0.3, 0.35)
  Top 0.762: v17.22,29.41 17.53,29.41 L2.1 | v17.22,28.45 18.45,28.45 | 18.45,28.45 L2.1 | v17.22,27.48 17.48,27.48 18.45,28.45 | 18.45,28.45 L2.1 | v17.22,29.41 18.45,29.41 18.45,28.45 | v17.22,27.48 18.47,27.48 L2.1 | v17.22,29.41 v17.22,28.45 | v17.22,27.48 v17.22,28.45
  Bottom 0.762: 18.82,27.48 18.64,27.48 v17.22,27.48 v17.22,28.45 | 18.82,27.48 18.82,24.33 v18.64,24.16 18.69,24.16 18.87,23.98 18.87,23.42 v18.82,23.37 18.87,23.32 v18.87,22.4 | v17.22,28.45 18.82,28.45 | 18.82,28.45 18.82,27.94 | 18.82,27.94 18.82,27.48 | v17.22,29.41 18.82,29.41 18.82,28.93 | 18.82,28.93 18.82,28.45 | v17.22,29.41 v17.22,28.45 | v17.22,28.45 17.22,27.94 18.82,27.94 | v17.22,29.41 17.22,29.39 17.22,28.93 18.82,28.93
  pour Top: 19.2,22.5 18.64,22.5 18.64,24.31 19.2,24.31
N$58
  Top 0.305: U11.13 JMP3.2
  Top 0.381: JMP3.2
N$59  (via drill 0.35)
  Top 0.152: v45.95,18.57 45.95,9.26 R11.1
  Bottom 0.152: v45.95,18.57 46,18.62 46,19.15 U1.38
N$60
  Top 0.152: LED1.2 R11.2
N$61
  Top 0.508: U13.7 24.13,17.02 R20.2 R19.1
N$62
  Top 0.305: U11.3 R6.1 R10.2
N$63  (via drill 0.3, 0.35)
  Top 0.762: L2.2 20.84,27.91 20.84,29.49 v22.1,29.49 | L2.2 v22.1,28.47 | v22.1,29.49 21.86,29.49 L2.2 | v22.1,27.51 21.81,27.51 L2.2 | v22.1,27.51 20.84,27.51 | v22.1,27.51 v22.1,28.47 | v22.1,28.47 v22.1,29.49
  Bottom 0.762: 20.34,28.02 20.34,24.28 v20.47,24.16 20.29,23.98 20.29,23.42 v20.34,23.37 20.29,23.32 v20.29,22.43 | v22.1,28.47 20.34,28.47 | 20.34,28.47 20.34,28.02 | 20.34,29.01 20.34,29.49 v22.1,29.49 22.1,28.96 | 20.34,29.01 20.34,28.47 | 22.1,28.96 v22.1,28.47 | v22.1,28.47 22.1,27.96 | 22.1,27.96 v22.1,27.51 | 20.34,28.02 22.1,28.02 22.1,27.96 | 20.34,29.01 20.34,28.96 22.1,28.96
  pour Top (no thermals): 20.52,22.5 19.96,22.5 19.96,24.31 20.52,24.31
N$64  (via drill 0.3)
  Top 0.254: U11.12 3.3,25.59
  Top 0.305: 3.3,25.59 2.43,25.59 C20.1 | U11.1 6.25,24.56 6.55,24.26 v6.68,24.26
  Top 0.381: C20.1 1.96,25.68 1.77,25.86 1.37,25.86 JMP3.1
  Bottom 0.508: v6.68,24.26 5.57,25.36 3.31,25.36 2.67,26.01 JMP3.1
  other vias: 1.23,26.01
N$65
  Top 0.508: U6.8 LS1.P$2
N$66
  Top 0.152: R3.2 38.15,24.23 36.88,22.96 U6.5
  Top 0.508: U6.5 LS1.P$1
N$69
  Top 0.152: R21.1
  Top 0.305: U14.6 R21.1
  Top 0.508: R21.1 R22.2
N$70
  Top 0.254: R18.2 20.95,20.96 21.16,21.16 21.16,21.93 U12.11 22.03,22.11 R17.1
N$71  (via drill 0.3)
  Top 0.305: v20.7,18.57 20.7,18.03 21.23,17.5 21.23,17.34 21.53,17.04 U13.2
  Bottom 0.508: R23.1 22.12,18.57 v20.7,18.57
N$72
  Top 0.305: 32.2,11.41 R24.2
  Top 0.381: 32.2,11.41 33.24,11.41 U14.7
N$74  (via drill 0.3)
  Top 0.305: U12.10 20.38,21.71 v20.47,21.61 | v17.98,21.31 16.94,21.31 JMP5.2
  Bottom 0.305: v17.98,21.31 18.23,21.61 v20.47,21.61
N$75
  Top 0.381: U14.8 32.74,10.21 C6.1
N$112
  Top 0.152: U2.45 65.81,32.83 66.16,32.47 67.98,32.47 68.86,33.35 68.86,34.38 70.58,36.09 Q2.1 C34.2
N$113
  Top 0.152: C35.2 Q2.3 70.95,33.14 69.2,33.14 68.17,32.11 66.04,32.11 65.72,32.43 U2.44
N$114
  Top 0.229: U2.2 63.34,36.09 L3.1 63.41,36.37 62.75,37.02 C45.2
N$115
  Top 0.152: C48.1 60.14,36.52 61.34,35.31 U2.7
N$116
  Top 0.152: C47.2 60.26,36.82 61.74,35.33 U2.6
N$117
  Top 0.152: U2.5 62.14,35.39 60.91,36.62 60.91,37.13 60.91,37.14 60.91,37.26 60.36,37.81 59.76,37.81 C47.1
N$118
  Top 0.152: U2.8 60.94,35.27 60.38,35.84 59.54,35.84 58.98,36.41 C48.2
N$119
  Top 0.152: U2.47 65.01,33.63 65.19,33.81 65.62,33.81 66.56,34.75 67.91,34.75 68.02,34.86 68.02,35.69 R15.2 C39.1
N$120
  Top 0.152: U2.48 64.89,34.03 65.06,34.19 65.48,34.19 66.42,35.13 67.44,35.13 C38.1 R15.1 C39.2
NSRST/PDI_CLK  (via drill 0.35)  (2 unrouted)
  Top 0.152: JMP2.1 37.84,37.98 v37.84,36.58 | JMP2.1 JMP2.2 38.76,39.68 37.49,40.95 37.49,43.21 38.12,43.84 v38.17,43.84 | v44.31,35.61 45.88,35.61 46.41,35.08 46.85,35.08 47.48,35.7 49.99,35.7 50.78,34.91 JTAG/PDI2.P$5 | v37.19,38.76 37.19,38.63 JMP2.1
  Bottom 0.152: U1.90 34.86,31.76 35.44,31.18 36.64,31.18 39.27,33.81 39.27,35.01 37.84,36.44 v37.84,36.58 | v44.31,35.61 44.31,35.8 41.25,38.85 40.29,38.85 39.73,38.3 37.97,38.3 37.52,38.76 v37.19,38.76 | v38.17,43.84 | v38.17,43.84 38.99,43.03
NTRST  (via drill 0.35)  (1 unrouted)
  Top 0.152: v47.29,37.06 46.94,37.41 v45.06,37.41
  Bottom 0.152: JTAG/PDI2.P$3_1 47.34,37.06 v47.29,37.06 | v45.06,37.41 43.2,37.41 41.38,39.24 40.15,39.24 39.93,39.02 38.07,39.02 36.98,40.11 35.89,40.11 35.05,40.95 35.05,43.82 35.81,44.58 38.55,44.58 J2.8
O  (via drill 0.35)
  Top 0.152: CP1.8 v21.59,35.59 | v21.59,33.78 22.12,33.25 22.76,33.25 23.14,32.87 24.92,32.87 25.3,32.49 28.22,32.49 30.48,30.23 36.17,30.23 v39.34,27.05
  Bottom 0.152: v21.59,33.78 v21.59,35.59 21.59,40.69 CN4.12 | v39.34,27.05 39.34,26.02 39.99,25.38 39.99,18.09 U1.48
PDI_DATA  (via drill 0.35)
  Top 0.152: JTAG.1 40.18,44.78 v40.01,44.96 v40,44.96
  Bottom 0.152: v40,44.96 35.63,44.96 34.44,43.76 34.44,40.73 39.63,35.55 39.63,33.64 36.82,30.82 35.09,30.82 34.51,31.41 U1.89
PS4  (via drill 0.35)
  Top 0.152: CP1.10 v19.3,35.59 | v19.3,33.78 19.84,33.25 20.47,33.25 20.85,32.87 21.49,32.87 21.87,32.49 22.5,32.49 22.88,32.11 24.66,32.11 25.04,31.73 27.96,31.73 30.23,29.46 35.41,29.46 v37.82,27.05
  Bottom 0.152: v19.3,33.78 v19.3,35.59 19.3,40.44 CN4.10 | v37.82,27.05 37.82,26.54 39.28,25.08 39.28,17.39 U1.50
R1  (via drill 0.35)
  Top 0.152: CP1.5 v25.02,39.65 | v25.02,33.78 25.55,33.25 28.47,33.25 30.73,30.99 36.93,30.99 v40.87,27.05
  Bottom 0.152: v25.02,39.65 v25.02,33.78 24.66,33.78 23.29,35.15 23.29,41.02 18.24,46.08 CN4.9 | v40.87,27.05 40.72,26.9 40.72,18.78 U1.46
R2  (via drill 0.35)
  Top 0.152: CP1.3 v27.3,39.65
  Bottom 0.152: v27.3,39.65 27.3,38.94 28.12,38.13 35.51,38.13 U1.100
R_LED  (via drill 0.35)
  Top 0.152: v70.46,26.54 71.96,26.54 72.7,27.28 v73.38,27.28
  Bottom 0.152: U1.37 47.45,18.41 50.93,18.41 52.64,18.41 55.46,21.22 64.88,21.22 70.19,26.54 v70.46,26.54 | v73.38,27.28 74.5,27.28 CN1.P$5
RESET  (via drill 0.3, 0.35)
  Top 0.152: U2.9 60.54,35.24 60.27,35.51 59.03,35.51 | 59.03,35.51 58.83,35.51 58.53,35.2 R13.1 56.72,34.37 55.56,34.37 53.28,32.08 47.96,32.08 45.95,34.09 v45.95,34.32 | Q3.2 v73.81,16.26 | v76.14,18.57 79.39,21.82 79.39,29.1 78.96,29.53 U5.9 77.96,29.6 78.31,29.6 78.55,29.84 v78.55,32.51 | 59.03,35.51 v59.03,35.58 | v38.73,30.77 37.74,31.75 31.24,31.75 v30.76,32.23 | v7.75,42.14 8.58,42.98 S2.2 S2.1 | JMP2.3 39.67,37.97 v39.67,37.2
  Bottom 0.152: v76.14,18.57 73.82,16.25 v73.81,16.25 v73.81,16.26 | v45.95,34.32 45.49,33.86 45.08,33.86 44.02,34.92 44.02,35.08 43.41,35.69 43.41,36.18 41.55,38.04 40.51,38.04 v39.67,37.2 40.33,36.55 40.66,36.55 40.98,36.22 40.98,35.76 39.99,34.77 39.99,32.17 38.73,30.92 v38.73,30.77 | v30.76,32.23 30.5,32.49 9.69,32.49 8.3,33.87 8.3,37.08 7.75,37.63 v7.75,42.14 | v59.03,35.58 61.93,35.58 62.46,36.12 63.84,36.12 64.81,35.15 64.81,34.16 65.1,33.87 71.14,33.87 71.66,33.35 77.71,33.35 v78.55,32.51
RIGHT  (via drill 0.35)
  Top 0.152: CP1.15 v13.59,39.65 | v13.59,33.78 14.12,33.25 14.76,33.25 15.14,32.87 15.77,32.87 16.15,32.49 16.79,32.49 17.17,32.11 18.95,32.11 19.35,31.7 19.96,31.7 20.32,31.34 20.98,31.34 21.36,30.96 22,30.96 22.38,30.58 24.15,30.58 24.54,30.2 27.43,30.2 29.64,27.99 33.84,27.99 v34.77,27.05
  Bottom 0.152: v13.59,33.78 v13.59,39.65 13.59,40.92 CN4.4 | U1.56 36.57,17.33 37.84,18.6 37.84,23.98 v34.77,27.05
RJS-BTN
  Bottom 0.152: JOYSTICK3.BTN3 JOYSTICK3.BTN1 69.63,14.68 59.29,14.68 56.46,17.51 46.22,17.51 U1.40
RJS-X  (via drill 0.35)
  Top 0.152: v44.25,33.93 44.25,28.83 47.14,25.94 47.14,18.23 v46.97,18.05
  Bottom 0.152: JOYSTICK3.X2 61.3,15.04 59.45,15.04 56.44,18.05 v46.97,18.05 | v44.25,33.93 44.04,34.14 43.54,34.14 U1.6
RJS-Y  (via drill 0.35)
  Top 0.152: v43.55,34.67 43.55,33.39 43.61,33.32 43.61,28.86 46.48,25.99 46.48,18.33 46.36,18.21 46.36,14.83 51.03,10.16 JOYSTICK3.Y2
  Bottom 0.152: v43.55,34.67 43.36,34.67 U1.5
RTS  (via drill 0.3, 0.35)
  Top 0.152: R16.2 76.78,13.51 76.78,14.07 75.94,14.91 75.94,15.95 74.46,17.43 Q3.3 73.5,17.14 v72.59,17.14 | v68.78,27.23 v68.78,21.77 | v68.94,29.17 69.16,29.17 69.2,29.12 70.8,29.12 72.7,31.03 U5.24
  Bottom 0.152: v72.59,17.14 71.81,17.14 68.78,20.17 v68.78,21.77 | v68.78,27.23 68.78,29.01 v68.94,29.17
RX
  Top 0.152: U2.40 65.14,30.83 67.75,28.21 71.05,28.21 72.87,30.03 U5.26
RX_XMEGA
  Bottom 0.152: U1.42 48.88,13.44 TP4.TP
SCK/CLK  (via drill 0.35)
  Top 0.152: U3.6 v59.92,26.29 | v61.98,26.29 61.74,26.52 U2.31
  Bottom 0.152: v59.92,26.29 v61.98,26.29
SCK_PORTC  (via drill 0.3, 0.35)
  Top 0.152: v52.46,28.42 52.21,28.68 v49.3,28.68
  Bottom 0.152: U1.22 49.31,28.6 49.3,28.61 v49.3,28.68 | U4.SCK 53.85,29.35 52.92,28.42 v52.46,28.42
SCL_PORTD  (via drill 0.35)
  Top 0.152: U2.39 65,30.43 66.61,28.82 v66.61,28.54
  Bottom 0.152: v66.61,28.54 66.44,28.36 66.44,24.32 64.44,22.32 54.5,22.32 52.84,23.99 U1.26
SCS/CMD
  Top 0.152: U3.1 63.27,23.75 61.34,25.68 U2.30
SDA_PORTD  (via drill 0.35)
  Top 0.152: U2.42 65.35,31.63 66.06,30.91 v66.31,30.91
  Bottom 0.152: v66.31,30.91 66.08,30.68 66.08,24.47 64.29,22.68 54.64,22.68 52.98,24.35 52.11,24.35 U1.25
SDI/SD1S  (via drill 0.35)
  Top 0.152: U3.5 58.98,27.56 v59.57,26.98 | U2.33 62.54,28.22 62.74,28.03 v62.74,27.56
  Bottom 0.152: v62.74,27.56 62.15,26.98 v59.57,26.98
SDO/SD0
  Top 0.152: U3.2 64.24,25.02 62.14,27.11 U2.32
SHD/SD2
  Top 0.152: U3.7 59.66,25.02 60.55,25.91 60.55,28.87 U2.28
SPEAKER_N  (via drill 0.35)
  Top 0.152: v42.22,32.25 41.73,31.76 41.73,27.76 42.37,27.13 C12.2
  Bottom 0.152: U1.7 42.36,32.25 v42.22,32.25 | U1.7 | U1.7
SPEAKER_P  (via drill 0.35)
  Top 0.152: C7.1 43.15,22 43.15,26.95 42.14,27.96 42.14,31.34 v42.27,31.47
  Top 0.305: C7.1 U6.2 U6.3
  Bottom 0.152: U1.8 | U1.8 | v42.27,31.47 42.28,31.47 U1.8
SWP/SD3  (via drill 0.35)
  Top 0.152: U3.3 v63.98,26.29 | v63.98,26.29 | v61.29,24.69 60.94,25.04 U2.29
  Bottom 0.152: v63.98,26.29 62.38,24.69 v61.29,24.69
TCK  (via drill 0.35)  (2 unrouted)
  Top 0.152: U2.20 58.27,31.23 58.24,31.2 57.49,31.2 57.3,31.01 v56.54,31.01 | v45.23,34.46 45.26,34.43 45.26,32.92 v45.41,32.77
  Bottom 0.152: v56.54,31.01 56.51,31.04 56.51,31.93 56.59,32 56.59,32.54 55.62,33.5 46.41,33.5 45.81,32.9 45.55,32.63 | U1.11 44.7,31.79 45.55,32.63 | v45.23,34.46 45.28,34.51 45.28,35.81 45.97,36.5 45.97,39.7 45.98,39.7 | v45.41,32.77 45.55,32.63 | 45.98,39.7 45.98,39.8 45.06,40.71 43.94,40.71 42.95,41.7 42.7,41.7 | 45.98,39.7 46.3,39.7 48.39,39.7 48.63,39.46 51.29,39.46 JTAG/PDI2.P10_1
TDI  (via drill 0.35)  (1 unrouted)
  Top 0.152: v43.05,31.37 43.26,31.57 43.26,33.17 v40.45,35.98 43.9,35.98 44.06,36.15 46.1,36.14 v46.63,35.61 | v38.99,36.94 38.05,35.99 37.44,35.99 35.03,38.41 35.03,44.18 35.56,44.71 39.04,44.71 39.64,44.1 v40.11,44.1 | JTAG/PDI2.P$2 JTAG/PDI2.P$2_1
  Bottom 0.152: U1.10 43.58,31.36 43.06,31.36 v43.05,31.37 | v40.45,35.98 40.41,35.95 39.98,35.95 v38.99,36.94 | JTAG/PDI2.P$2_1 48.06,37.62 46.99,37.62 46.73,37.36 46.73,35.71 v46.63,35.61 | 41.38,43.1 40.38,44.1 v40.11,44.1
TDO  (via drill 0.3)
  Top 0.152: U2.21 57.66,30.83 57.25,30.42 56.72,30.42 52.19,25.88 47.86,25.88 44.79,28.95 44.79,34.13 44.68,34.24 44.68,34.88 v44.73,34.93 | JTAG.3 43.89,44.78 45.59,43.08 45.59,39.73 v45.44,39.57
  Bottom 0.152: v45.44,39.57 45.59,39.42 45.59,36.63 44.86,35.89 44.86,35.06 v44.73,34.93
TDO/PDI_DATA  (via drill 0.35)  (2 unrouted)
  Top 0.152: 42.72,40.82 44.47,39.07 v46.91,39.07 | JTAG.2 42.01,44.25 42.72,43.54 42.72,40.82 | v40.74,40.82 42.72,40.82
  Bottom 0.152: v46.91,39.07 47.29,38.69 50.61,38.69 51.86,37.44 JTAG/PDI2.P$8_1 | v40.74,40.82 40.11,41.45 40.11,41.68
TDO_XMEGA-TDI_ESP32  (via drill 0.35)
  Top 0.152: U2.18 58.57,32.05 57.41,32.05 57.3,32.15 56.21,32.15 v56.06,32.31
  Bottom 0.152: v56.06,32.31 56.06,32.55 55.46,33.14 46.58,33.14 45.64,32.2 45.64,32 U1.12
TMS  (via drill 0.35)  (2 unrouted)
  Top 0.152: U2.17 57.63,32.43 57.35,32.7 v57.12,32.7 | v46.56,38.38 46.25,38.68 43.91,38.68 42.34,40.26 38.96,40.26 v38.76,40.46
  Bottom 0.152: v57.12,32.7 56.93,32.7 55.77,33.86 46.76,33.86 46.48,33.86 | 46.48,33.86 46.24,33.86 45.69,33.31 44.83,33.31 U1.9 | 46.48,33.86 46.48,34.72 46,35.2 46,36.02 46.35,36.37 46.35,38.18 v46.56,38.38 46.61,38.33 49.88,38.33 JTAG/PDI2.P$6_1 | v38.76,40.46 37.49,41.73 37.49,41.76
TX
  Top 0.152: U2.41 65.24,31.23 67.88,28.59 70.92,28.59 72.87,30.53 U5.25
TX_XMEGA
  Bottom 0.152: U1.41 44.4,18.68 47.61,15.47 TP5.TP
UP  (via drill 0.35)
  Top 0.152: CP1.14 v14.73,35.59 | v14.73,33.78 15.26,33.25 15.9,33.25 16.28,32.87 16.91,32.87 17.3,32.49 19.07,32.49 19.48,32.08 20.12,32.08 20.47,31.73 21.11,31.73 21.49,31.34 22.12,31.34 22.5,30.96 24.28,30.96 24.66,30.58 27.56,30.58 29.8,28.34 34.24,28.34 v35.53,27.05
  Bottom 0.152: v14.73,33.78 v14.73,35.59 14.73,42.47 CN4.5 | U1.55 36.92,16.98 38.2,18.25 38.2,24.39 v35.53,27.05
USB_N  (via drill 0.35)
  Top 0.152: v53.67,21.21 71.55,21.21 73.05,22.71 73.56,22.71 75.36,24.51 v76.22,24.51 76.5,24.78 76.5,26.66 76.14,27.01 76.14,28.18 U5.5
  Bottom 0.152: U1.31 47.93,22.22 48.94,21.21 v53.67,21.21 | v76.22,24.51 JMP4.2 77.34,23.34 77.62,23.34 78.68,24.4 78.68,25.85 79.37,26.53 CN3.D-
USB_P  (via drill 0.35)
  Top 0.152: v72.13,24.23 72.13,26.19 72.69,26.75 74.7,26.75 75.59,27.64 U5.4 | v53.12,20.67 v55.67,20.67
  Bottom 0.152: U1.32 48.11,21.28 48.34,21.28 48.95,20.67 v53.12,20.67 | v55.67,20.67 55.85,20.85 65.02,20.85 69.77,25.6 CN1.P$10 72.13,24.84 v72.13,24.23 72.11,24.21 72.11,23.62 71.65,23.16 71.65,22.33 71.93,22.05 72.52,22.05 74.47,20.09 77.67,20.09 79.07,21.49 79.07,25.55 79.4,25.88 CN3.D+
VBAT  (via drill 0.3, 0.35)
  Top 0.305: U10.5 15.39,27.66 v15.77,27.28
  Top 0.508: S1.2 41.51,6.66 v41.53,6.68 | v15.29,13.84 15.29,13.87 v13.49,15.67 | R7.2 6.41,19.27 v6.4,19.25 | v9.37,28.45 7.85,26.92 v7.31,26.92 | R4.2 15.39,29.46 U10.5
  Bottom 0.305: v9.37,28.45 9.45,28.52 9.83,28.52 10.87,27.48 15.57,27.48 v15.77,27.28
  Bottom 0.508: v41.53,6.68 40.51,7.7 38.58,7.7 36.19,5.31 23.85,5.31 20.61,8.55 18.65,8.55 15.77,11.43 15.77,13.36 v15.29,13.84 | v13.49,15.67 12.7,14.88 8.69,14.88 7.53,16.04 | CN2.P$1 7.42,26.17 C9.1 | C9.1 7.53,19.2 | 7.53,19.2 7.53,16.04 | v6.4,19.25 6.45,19.2 7.53,19.2 | v7.31,26.92 7.31,26.28 C9.1 | TP1.TP 7.09,16.04 7.53,16.04
VBATOUT  (via drill 0.3)
  Top 0.254: U11.11 U11.10 | U12.8 19,21.71
  Top 0.305: U11.10 3.35,26.54 3.35,26.43
  Top 0.381: C31.1 35.89,10.21 U14.1 35.36,11.32 U14.2
  Top 0.508: 3.35,26.43 3.32,26.41 2.52,26.41 C23.1 1.78,27.15 1.12,27.15 1.09,27.18 v1,27.18 | v13.62,17.18 13.62,16.62 16.16,14.08 16.16,13.07 | C31.1 37.49,9.37 39.75,7.12 S1.C 39.75,7.21 41.1,8.56 C30.1 41.92,8.09 U$2.4 42.84,7.54 43.08,7.3 43.88,7.3 44.13,7.54 U$2.6 | v36.42,11.07 35.67,11.07 35.42,11.32 35.36,11.32 | U12.7 17.57,22.11 17.49,22.2 16.99,22.2 JMP5.1 | U12.7 U12.6 U12.5 | U12.5 U12.4 17.98,23.81 C26.1 | 19,21.71 18.58,21.71 U12.7 | U13.1 21.39,18.21 C5.1 21.39,18.87 20.9,19.36 20.37,19.36 19.99,18.97 v19.99,18.11 | TP3.TP 3.98,6.68 4.61,6.04 6.74,6.04 13.77,13.07 16.16,13.07 | 16.16,13.07 17.37,11.86 17.37,11.84 20.78,11.84 21.51,12.57 v21.54,12.55 21.54,12.6 21.91,12.97 21.91,12.98 U13.4 U13.3 v21.06,16.38 | v17.42,23.11 U12.5
  Bottom 0.508: v1,27.18 1,30.48 1.79,31.27 5.27,31.27 8.66,27.88 8.98,27.88 9.84,27.03 10.21,27.03 11,26.23 11,25.95 11,21.99 12.6,20.4 | v13.62,17.18 13.11,17.68 13.11,19.88 12.6,20.4 | v21.54,12.55 23.32,10.77 26.49,10.77 28,9.26 35.45,9.26 36.42,10.23 v36.42,11.07 | 12.6,20.4 13.61,21.41 13.61,21.82 14.22,22.43 16.55,22.43 17.24,23.11 v17.42,23.11 | v21.06,16.38 20.93,16.5 20.93,17.14 19.99,18.09 v19.99,18.11
  pour Top (rank 2): 3.02,26.67 3.02,25.93 3.61,25.93 3.63,25.93 3.63,26.7 3.02,26.7
VDD_SDIO
  Top 0.229: U2.26 59.73,28.28 59.62,28.17 57.11,28.17 56.08,27.14 C49.1 56.08,24.43 56.77,23.75 U3.8
VUSB  (via drill 0.35)  (1 unrouted)
  Top 0.305: v75.82,25.93 73.33,25.93 v73.1,26.16
  Top 0.381: v78.59,28.93 78.54,28.98 77.94,28.98 U5.8
  Top 0.508: v78.59,28.93 78.79,28.73 78.79,26.7 78.54,26.44 | D1.2 55.98,6.25 57.53,6.25 72.86,21.58 73.03,21.41 | 78.54,26.44 v77.22,26.44 77.22,24.42 76.54,23.75 75.39,23.75 C21.1 | 78.54,26.44 78.33,26.24 C22.1 | C21.1
  Bottom 0.305: v77.22,26.44 76.38,26.44 75.88,25.93 v75.82,25.93 | v73.1,26.16 74.31,26.16 CN1.P$7
  Bottom 0.381: v78.59,28.93 78.59,27.53 78.93,27.19 78.88,27.18 CN3.VBUS
X  (via drill 0.35)
  Top 0.152: CP1.9 v20.44,39.65 v20.45,39.65 | v20.45,33.78 20.98,33.25 21.61,33.25 22,32.87 22.63,32.87 23.01,32.49 24.79,32.49 25.17,32.11 28.09,32.11 30.35,29.84 35.79,29.84 v38.58,27.05
  Bottom 0.152: v20.45,33.78 v20.45,39.65 20.01,40.08 20.01,42.27 CN4.11 | v38.58,27.05 38.58,26.28 39.64,25.23 39.64,17.74 U1.49
(copper drawn outside any net)
  shapes: Bottom area x2, Bottom circle x1, Top area x7, Top circle x1

## Text on the board
tNames: V3 | JDM-055 / compatible
bNames: Tuege / Neumann | PROJEKT BLU. | R1, A, L1 | The University / of Manchester | X, Left, Up, # | O, PS4, Down, Right, - | TX | RX | VBAT | GND
_tPlace: C68 | C67 | C70 | C69 | C66 | C63 | C72 | C71 | C65 | R15 | C45 | R13 | C64 | R12 | R4 | C43 | C74 | C27 | C29 | C28 | C44 | C19 | R6 | C30 | C31 | R3 | R10 | C32 | C12 | C20 | C73 | R17 | C8 | R2 | R18 | C37 | C7 | C5 | R14 | R19 | R20 | R24 | C36 | C33 | R21 | R16 | R22 | C35 | C34 | C6
_bPlace: C16 | C17 | C18 | C15 | C14 | C3 | CN1 | R23 | C13 | C11 | C4 | C10
_tNames: SV4 | JMP1 | S4 | JTAG/PDI | C41 | D5 | L3 | C42 | L1 | JMP2 | Q2 | U21 | L2 | TP2 | R9 | R8 | SJ2 | C1 | IC2 | C24 | U13 | U22 | U3 | U11 | C22 | JMP3 | SJ1 | JMP5 | R1 | R7 | C2 | U14 | Q3 | TP5 | U9 | TP4 | Q1 | U2 | U15 | TP1 | R5 | U8 | D2 | TP6 | R11 | TP3 | LED9
_bNames: LED7 | LED8 | CN3 | C9 | J4 | JMP4 | U10 | IC1 | SJ5